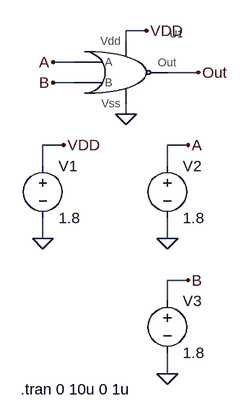
[diagram p0: schematic Draft1.asc]
Draft1.asc, the LTspice schematic file:
Version 4
SHEET 1 880 680
WIRE 208 96 176 96
WIRE 176 112 176 96
WIRE 96 144 64 144
WIRE 288 160 240 160
WIRE 96 176 64 176
WIRE 176 224 176 208
WIRE 80 272 48 272
WIRE 272 272 240 272
WIRE 48 304 48 272
WIRE 240 304 240 272
WIRE 48 416 48 384
WIRE 240 416 240 384
WIRE 272 480 240 480
WIRE 240 512 240 480
WIRE 240 624 240 592
FLAG 64 144 A
FLAG 64 176 B
FLAG 208 96 VDD
FLAG 176 224 0
FLAG 288 160 Out
FLAG 48 416 0
FLAG 240 416 0
FLAG 240 624 0
FLAG 80 272 VDD
FLAG 272 272 A
FLAG 272 480 B
SYMBOL NOR1 112 160 R0
SYMATTR InstName U1
SYMBOL voltage 48 288 R0
WINDOW 123 0 0 Left 0
WINDOW 39 0 0 Left 0
SYMATTR InstName V1
SYMATTR Value 1.8
SYMBOL voltage 240 288 R0
WINDOW 123 0 0 Left 0
WINDOW 39 0 0 Left 0
SYMATTR InstName V2
SYMATTR Value 1.8
SYMBOL voltage 240 496 R0
WINDOW 123 0 0 Left 0
WINDOW 39 0 0 Left 0
SYMATTR InstName V3
SYMATTR Value 1.8
TEXT 14 648 Left 2 !.tran 0 10u 0 1u

The netlist it stands for:
* Draft1.asc
XU1 VDD 0 Out A B NOR1  ; pins Vdd Vss Out A B
V1 VDD 0 1.8
V2 A 0 1.8
V3 B 0 1.8
.tran 0 10u 0 1u
.lib NOR1.sub
.backanno
.end